# Altium schematic sheet Schematic.SchDoc
size A
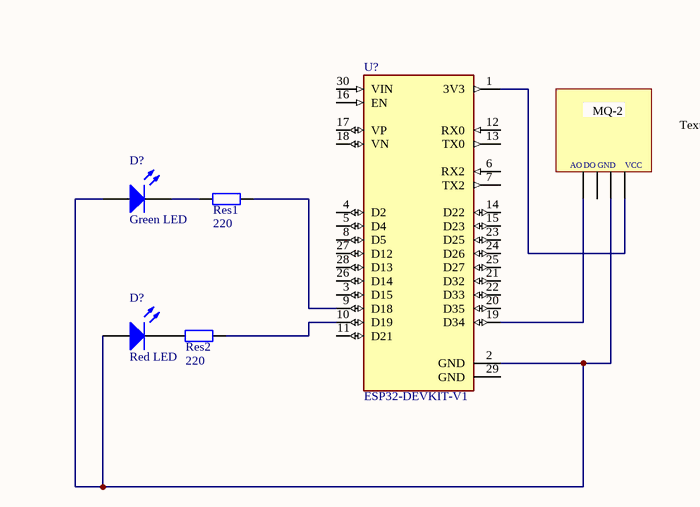
[diagram p0: Schematic.SchDoc]

## Parts
(Parts that share a designator on the sheet are numbered #1, #2 ... from top to bottom, then left to right.)
?#1  Res1  value 220  [AXIAL-0.4]
?#2  Res2  value 220  [AXIAL-0.4]
D?#1  Green LED  [3.2X1.6X1.1]
D?#2  Red LED  [3.2X1.6X1.1]
U?  ESP32-DEVKIT-V1  [MODULE_ESP32_DEVKIT_V1]

## Nets
Net?#1_1: ?#1.1 D?#1.2(K)
Net?#1_2: ?#1.2 U?.9(D18)
Net?#2_1: ?#2.1 D?#2.2(K)
Net?#2_2: ?#2.2 U?.10(D19)
NetD?#1_1: D?#1.1(A) D?#2.1(A) U?.2(GND)

Not connected (* = marked no-connect by the designer): U? 1(3V3) 3(D15) 4(D2) 5(D4) 6(RX2) 7(TX2) 8(D5) 11(D21) 12(RX0) 13(TX0) 14(D22) 15(D23) 16(EN) 17(VP) 18(VN) 19(D34) 20(D35) 21(D32) 22(D33) 23(D25) 24(D26) 25(D27) 26(D14) 27(D12) 28(D13) 29(GND) 30(VIN)

## Notes on the sheet
- MQ-2
- Text
- AO
- DO
- GND
- VCC

## Library data of the parts
?#1 ?#2 = Res2: Resistor; Published: 8-Jun-2000; LatestRevisionDate: 17-Jul-2002; LatestRevisionNote: Re-released for DXP Platform.; PackageReference: AXIAL-0.4; Publisher: Altium Limited; PackageDescription: Axial Device, Thru-Hole; 2 Leads; 0.4 in Pin Spacing
D?#1 D?#2 = LED2: Typical RED, GREEN, YELLOW, AMBER GaAs LED; Published: 8-Jun-2000; LatestRevisionDate: 17-Jul-2002; LatestRevisionNote: Re-released for DXP Platform.; PackageVersion: Feb-2002; PackageReference: 3.2X1.6X1.1; Publisher: Altium Limited; PackageDescription: SM LED; 2 Flat Leads
U? = ESP32-DEVKIT-V1: Dual core, Wi-Fi: 2.4 GHz up to 150 Mbits/s,BLE (Bluetooth Low Energy) and legacy Bluetooth, 32 bits, Up to 240 MHz; MF: Do it; SnapEDA_Link: https://www.snapeda.com/parts/ESP32-DEVKIT-V1/Do+it/view-part/?ref=snap; Package: None; Value: *; MP: ESP32-DEVKIT-V1; Check_prices: https://www.snapeda.com/parts/ESP32-DEVKIT-V1/Do+it/view-part/?ref=eda